# Altium schematic sheet Current_regulation.SchDoc
size A4; SheetNumber: 1; SheetTotal: 2
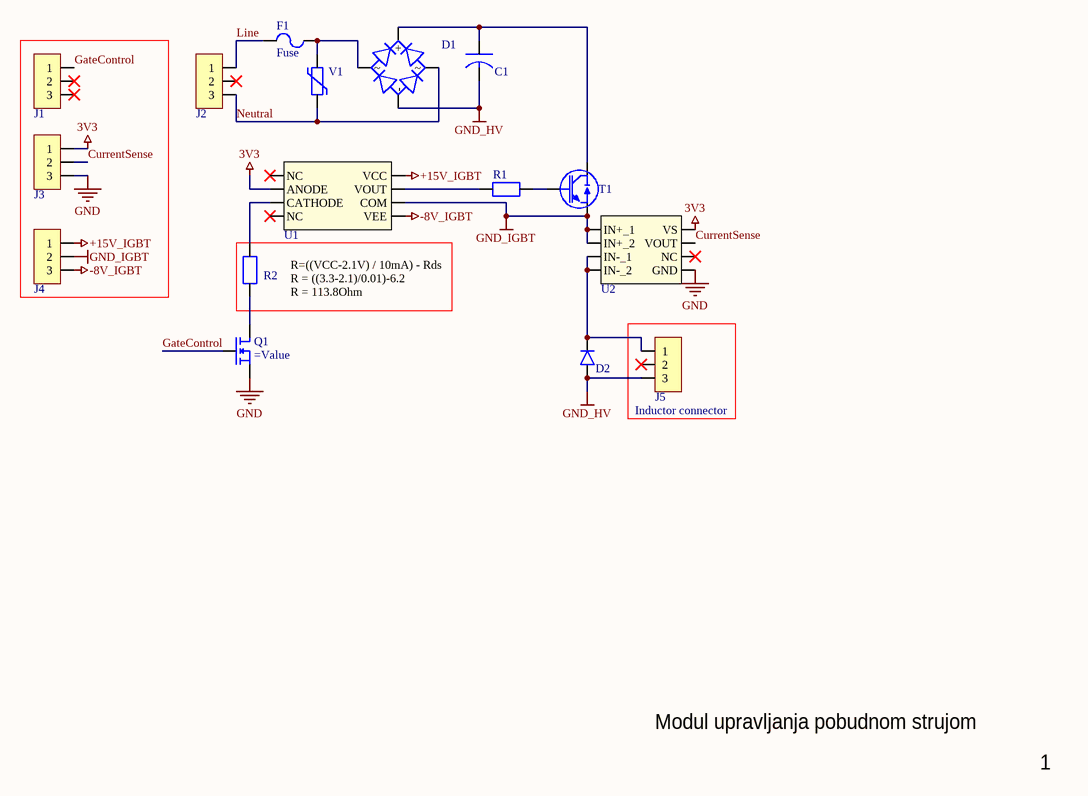
[diagram p0: Current_regulation.SchDoc]

## Parts
C1  Capacitor-P  [C-P-400V]  (value not drawn)
D1  KBJ2010_T0_00601  [SIP480W100P750L2530H1340Q4]  (value not drawn)
D2  Diode  [Diode-6A]  (value not drawn)
F1  Fuse  [FuseHolder]
J1  Molex Micro-Latch  [ScrewTerminal]  (value not drawn)
J2  Molex Micro-Latch  [ScrewTerminal]  (value not drawn)
J3  Molex Micro-Latch  [ScrewTerminal]  (value not drawn)
J4  Molex Micro-Latch  [ScrewTerminal]  (value not drawn)
J5  Molex Micro-Latch  [ScrewTerminal]  (value not drawn)
Q1  (no value)  [MOSFET]
R1  1k  [R-2W]  (value not drawn)
R2  120Ohm  [R-2W]  (value not drawn)
T1  IKA08N65ET6XKSA1  [TO254P1065X485X2200-3]  (value not drawn)
U1  UCC23514EDWVR  [SOIC8P127_585X1150X280L75X41N]  (value not drawn)
U2  TMCS1108A3BQDT  [SOIC8P127_490X599X200L104X41N]  (value not drawn)
V1  Varistor  [VARRBO750W80L1350T640H1650]  (value not drawn)

## Blocks framed on the sheet
Inductor connector: J5

## Nets
3V3: J3.1 U1.2(ANODE) U2.8(VS)
+15V_IGBT: J4.1 U1.8(VCC)
-8V_IGBT: J4.3 U1.5(VEE)
GND: J3.3 Q1.3 U2.5(GND)
GND_HV: C1.1 D1.2(-) D2.A J5.3
GND_IGBT: J4.2 T1.3(E) U1.6(COM) U2.1(IN+_1) U2.2(IN+_2)
CurrentSense: J3.2 U2.7(VOUT)
GateControl: J1.1 Q1.1
Line: F1.1 J2.1
Neutral: D1.4 J2.3 V1.1
NetC1_2: C1.2 D1.1(+) T1.2(C)
NetD1_3: D1.3 F1.2 V1.2
NetD2_C: D2.C J5.1 U2.3(IN-_1) U2.4(IN-_2)
NetQ1_2: Q1.2 R2.2
NetR1_1: R1.1 T1.1(G)
NetR1_2: R1.2 U1.7(VOUT)
NetR2_1: R2.1 U1.3(CATHODE)

Not connected (* = marked no-connect by the designer): J1 2* 3*; J2 2*; J5 2*; U1 1(NC)* 4(NC)*; U2 6(NC)*

## Notes on the sheet
- R=((VCC-2.1V) / 10mA) - Rds
  R = ((3.3-2.1)/0.01)-6.2
  R = 113.8Ohm
- Modul upravljanja pobudnom strujom
- 1

## Library data of the parts
C1 = Capacitor-P: Value: 47uF
D1 = KBJ2010_T0_00601: Max Reverse Voltage: 1kV; Diode Type: Bridge rectifier; Diode Case Style: KBJ-2; Forward Current: 20A; ComponentLinkDescription: Datasheet; FR_SN: D-07; Part Number: KBJ2010_T0_00601; Value: KBJ2010_T0_00601; Reverse Recovery Time: -; Manufacturer Part Number: KBJ2010_T0_00601; ComponentLinkURL: https://hr.mouser.com/datasheet/2/1057/KBJ2010-2999227.pdf; Supplier Part Number: 241-KBJ2010_T0_00601
F1 = F_30A: Part Number: F_30A; Value: Fuse holder; FR_SN: F-04
J1-J5 = Molex Micro-Latch 1x3: Manufacturer Part Number: 53254-0370; ComponentLinkDescription: Datasheet; FR_SN: J-13; Part Number: Molex Micro-Latch 1x3; Value: Molex Micro-Latch; ComponentLinkURL: https://hr.mouser.com/datasheet/2/276/0532540370_PCB_HEADERS-171041.pdf; Supplier Part Number: 538-53254-0370
Q1 = MOSFET
R1 R2 = Resistor
  R1: Value: 1k
  R2: Value: 120Ohm
T1 = IKA08N65ET6XKSA1: Power Dissipation Pd: 33 W; Continuous Drain Current Id: 11 A; Drain Source Voltage Uds: 1.5 V; Transistor Case Style: TO-220FP-3; ComponentLinkDescription: Datasheet; FR_SN: T_M-16; Part Number: IKA08N65ET6XKSA1; Value: IKA08N65ET6XKSA1; On Resistance Rds(on): -; Manufacturer Part Number: IKA08N65ET6XKSA1; ComponentLinkURL: https://hr.mouser.com/datasheet/2/196/Infineon_IKA08N65ET6_DataSheet_v01_00_EN-1731522.pdf; Supplier Part Number: 726-IKA08N65ET6XKSA1
U1 = UCC23514EDWVR: IC Case Style: SOIC-8; ComponentLinkDescription: Datasheet; FR_SN: IC_D-18; Part Number: UCC23514EDWVR; Value: UCC23514EDWVR; Category: MOSFET/IGBT gate driver; Manufacturer Part Number: UCC23514EDWVR; ComponentLinkURL: https://www.ti.com/general/docs/suppproductinfo.tsp?distId=26&gotoUrl=https://www.ti.com/lit/gpn/ucc23514; Supplier Part Number: 595-UCC23514EDWVR
U2 = TMCS1108A3BQDT: IC Case Style: SOIC-8; ComponentLinkDescription: Datasheet; FR_SN: U_Analog-21; Part Number: TMCS1108A3BQDT; Value: TMCS1108A3BQDT; Category: Current Sensor; Manufacturer Part Number: TMCS1108A3BQDT; ComponentLinkURL: www.ti.com/lit/ds/symlink/tmcs1108.pdf?HQS=dis-mous-null-mousermode-dsf-pf-null-wwe&ts=1664483891528&ref_url=https%253A%252F%252Fpt.mouser.com%252F; Supplier Part Number: 595-TMCS1108A3BQDT
V1 = B72314S2351K101: FR_SN: Var-01; Part Number: B72314S2351K101